# Altium schematic sheet Sheet1.SchDoc
size A; DocumentNumber: 7; SheetNumber: 8; SheetTotal: 9
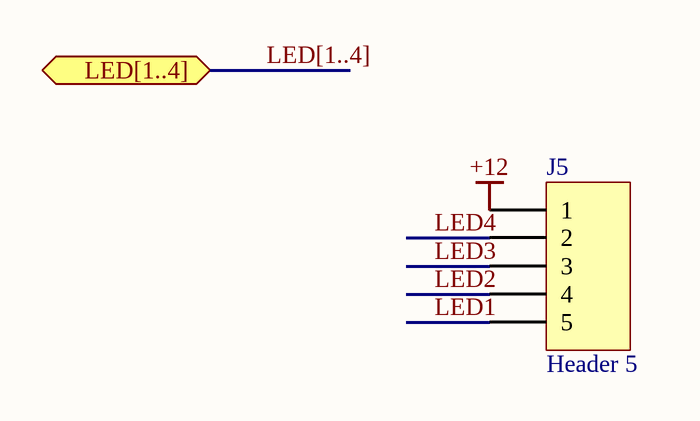
[diagram p0: Sheet1.SchDoc]

## Parts
J5  Header 5  [CONN. 5]

## Ports
LED[1..4] (bidir)

## Nets
+12: J5.1
LED1: J5.5
LED2: J5.4
LED3: J5.3
LED4: J5.2

## Buses and harness runs
bus LED[1..4] = port LED[1..4]

## Library data of the parts
J5 = TermBlock 5: Header, 5-Pin; LatestRevisionDate: 17-Jul-2002; LatestRevisionNote: Re-released for DXP Platform.; Publisher: Altium Limited